# Altium schematic sheet DeviceControl.SchDoc
size A2
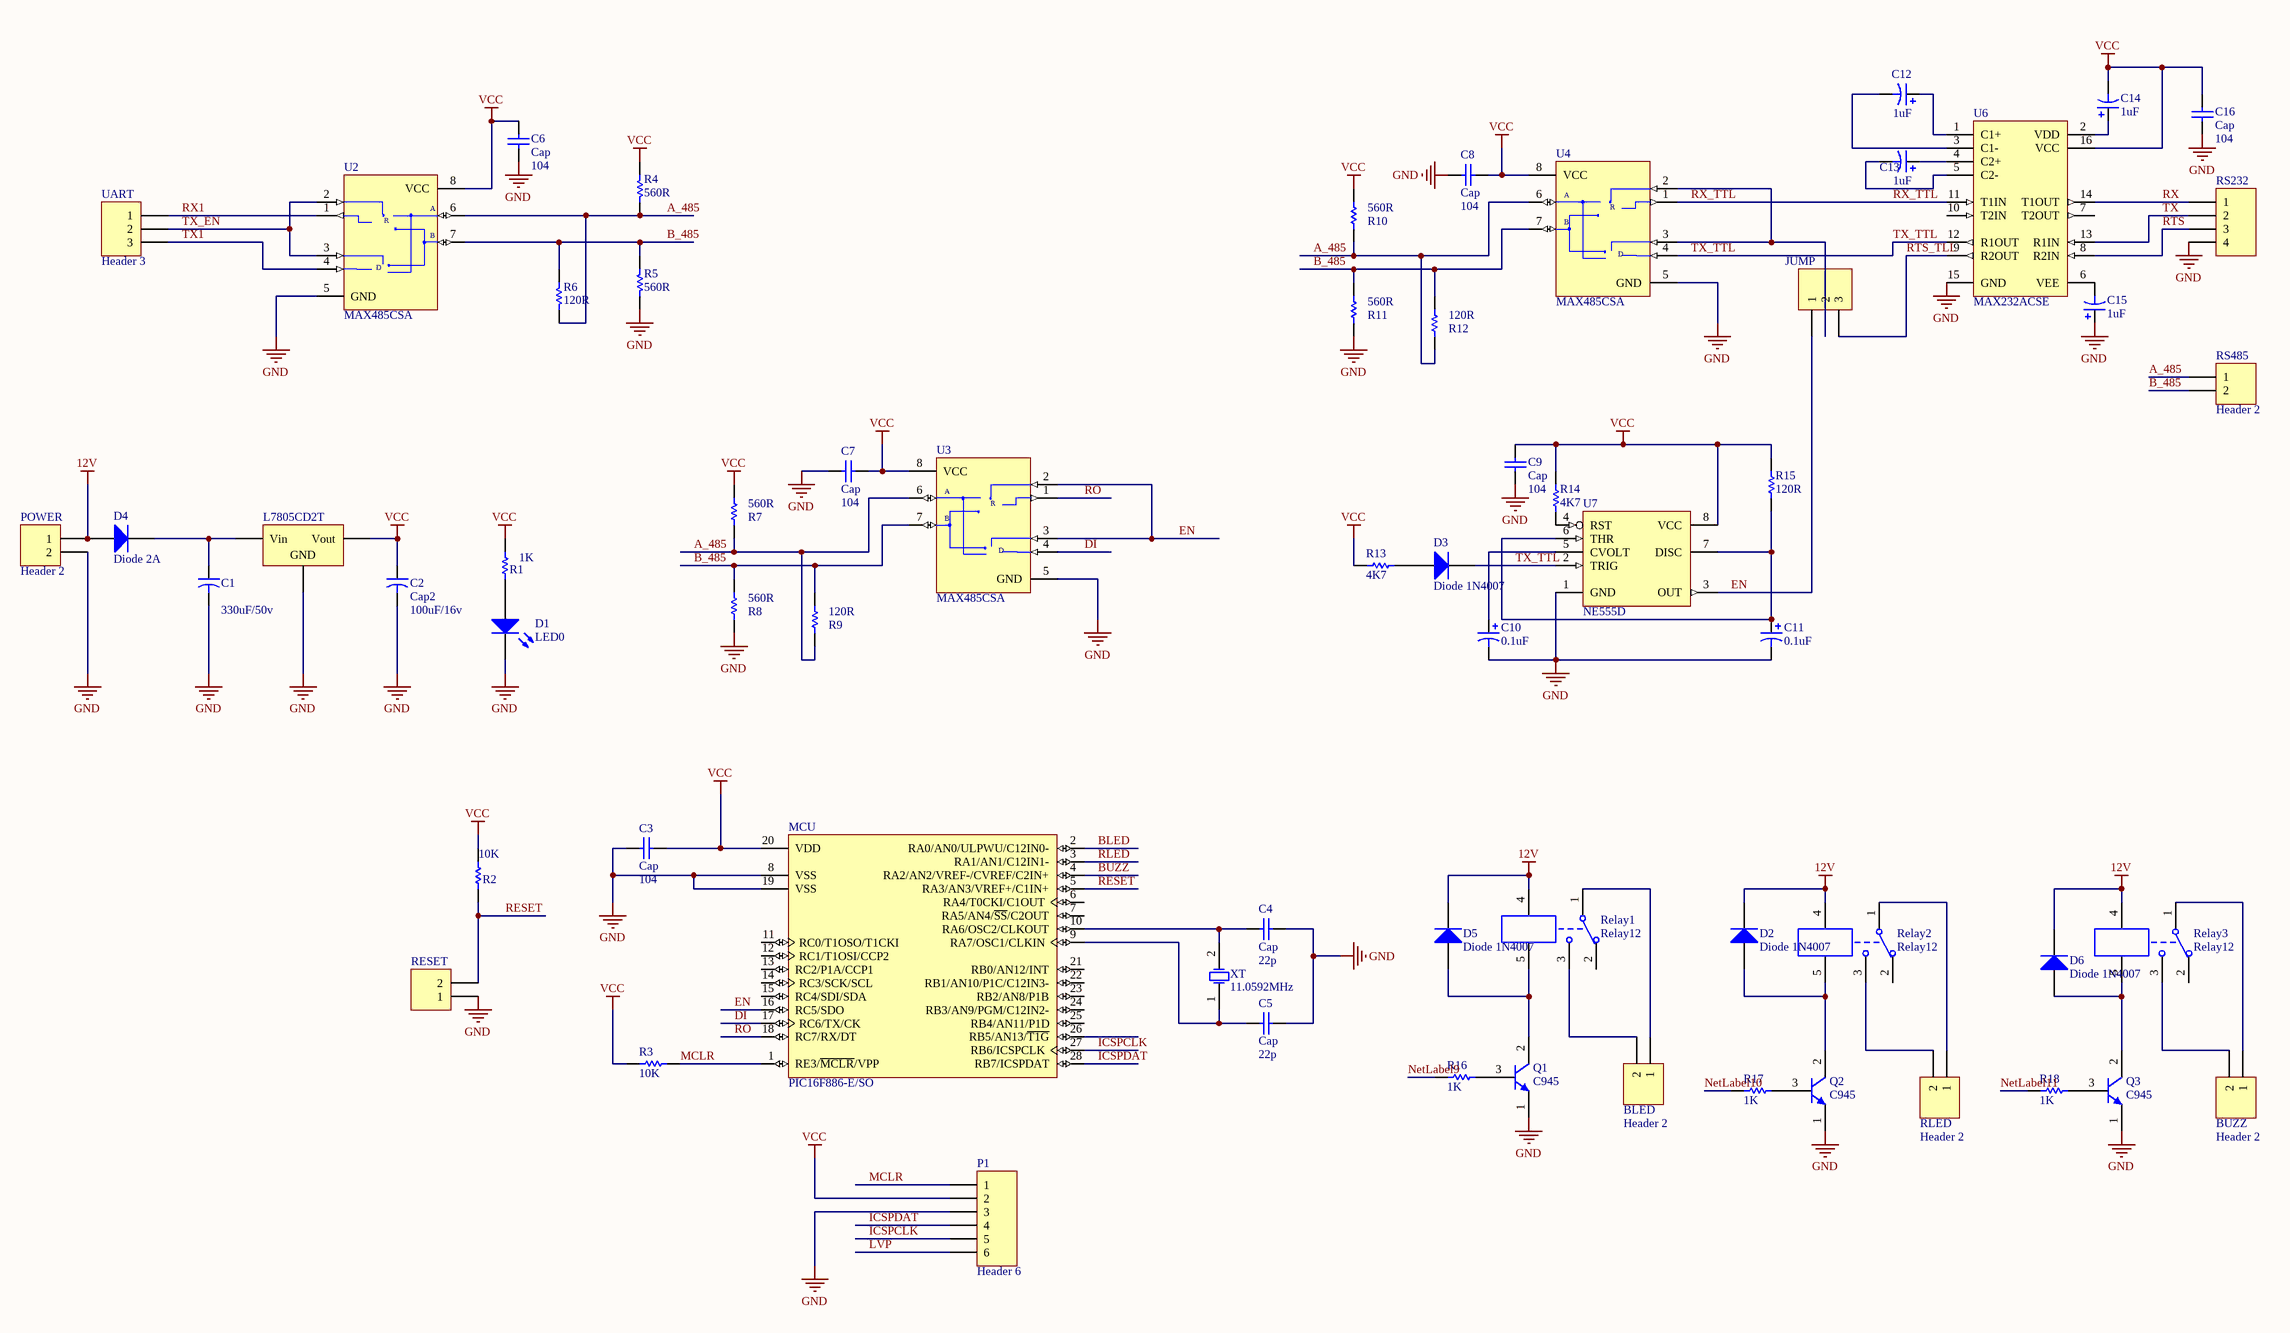
[diagram p0: DeviceControl.SchDoc]

## Parts
BLED  Header 2  [Header2 - duplicate]
BUZZ  Header 2  [Header2 - duplicate]
C1  value 330uF/50v  [TU 220uF/50V]  (hidden comment: Cap2)
C2  Cap2  value 100uF/16v  [tu 100uF/50v]
C3  Cap  value 104  [C104_YELLOW]
C4  Cap  value 22p  [C104_PINK]
C5  Cap  value 22p  [C104_PINK]
C6  Cap  value 104  [C104_PINK]
C7  Cap  value 104  [C104_YELLOW]
C8  Cap  value 104  [C104_PINK]
C9  Cap  value 104  [C104_PINK]
C10  value 0.1uF  [C104_YELLOW]  (hidden comment: Cap Pol1)
C11  value 0.1uF  [C104_YELLOW]  (hidden comment: Cap Pol1)
C12  value 1uF  [tu 10uF]  (hidden comment: Cap Pol1)
C13  value 1uF  [tu 10uF]  (hidden comment: Cap Pol1)
C14  value 1uF  [tu 10uF]  (hidden comment: Cap Pol1)
C15  value 1uF  [tu 10uF]  (hidden comment: Cap Pol1)
C16  Cap  value 104  [C104_PINK]
D1  LED0  [LED_3]
D2  Diode 1N4007  [DIO10.46-5.3x2.8]
D3  Diode 1N4007  [D_1A]
D4  Diode 2A  [D_2A]
D5  Diode 1N4007  [DIO10.46-5.3x2.8]
D6  Diode 1N4007  [DIO10.46-5.3x2.8]
JUMP  Header 3  [HDR1X3]  (value not drawn)
L7805CD2T  Volt Reg  [TO254P1510-3_4N]  (value not drawn)
MCU  PIC16F886-E/SO  [SOIC-SO28_N]
P1  Header 6  [HDR1X6]
POWER  Header 2  [Header2 - duplicate]
Q1  C945  [C1815]
Q2  C945  [C1815]
Q3  C945  [C1815]
R1  1K  [R_Nor]
R2  10K  [R_Nor]
R3  10K  [R_Nor]
R4  560R  [R_Nor]
R5  560R  [R_Nor]
R6  120R  [R_Nor]
R7  560R  [R_Nor]
R8  560R  [R_Nor]
R9  120R  [R_Nor]
R10  560R  [R_Nor]
R11  560R  [R_Nor]
R12  120R  [R_Nor]
R13  4K7  [R_Nor]
R14  4K7  [R_Nor]
R15  120R  [R_Nor]
R16  1K  [R_Nor]
R17  1K  [R_Nor]
R18  1K  [R_Nor]
Relay1  Relay12  [Role 12V]
Relay2  Relay12  [Role 12V]
Relay3  Relay12  [Role 12V]
RESET  Header 2  [Header2 - duplicate]  (value not drawn)
RLED  Header 2  [Header2 - duplicate]
RS232  Header 4  [HDR1X4]  (value not drawn)
RS485  Header 2  [HDR1X2]
U2  MAX485CSA  [NSO8_N]
U3  MAX485CSA  [NSO8_N]
U4  MAX485CSA  [NSO8_N]
U6  MAX232ACSE  [NSO16_N]
U7  NE555D  [D008_N]
UART  Header 3  [HDR1X3]
XT  value 11.0592MHz  [Xtal12M]  (hidden comment: XTAL)

## Nets
12V: D2.2(K) D4.1(A) D5.2(K) D6.2(K) POWER.1 Relay1.4 Relay2.4 Relay3.4
GND: C1.2 C2.2 C3.2 C4.2 C5.2 C6.2 C7.1 C8.1 C9.1 C10.2 C11.2 C15.1 C16.1 D1.2(K) L7805CD2T.2(GND) MCU.8(VSS) MCU.19(VSS) P1.3 POWER.2 Q1.1(E) Q2.1(E) Q3.1(E) R5.1 R8.1 R11.1 RESET.1 RS232.4 U2.5(GND) U3.5(GND) U4.5(GND) U6.15(GND) U7.1(GND)
VCC: C2.1 C3.1 C6.1 C7.2 C8.2 C9.2 C14.2 C16.2 L7805CD2T.3(Vout) MCU.20(VDD) P1.2 R1.2 R2.2 R3.2 R4.2 R7.2 R10.2 R13.2 R14.1 R15.1 U2.8(VCC) U3.8(VCC) U4.8(VCC) U6.16(VCC) U7.8(VCC)
A_485: R4.1 R6.1 R7.1 R9.1 R10.1 R12.1 RS485.1 U2.6(A) U3.6(A) U4.6(A)
B_485: R5.2 R6.2 R8.2 R9.2 R11.2 R12.2 RS485.2 U2.7(B) U3.7(B) U4.7(B)
BLED: MCU.2(RA0/AN0/ULPWU/C12IN0-)
BUZZ: MCU.4(RA2/AN2/VREF-/CVREF/C2IN+)
DI: MCU.17(RC6/TX/CK) U3.4(DI)
EN: JUMP.1 MCU.16(RC5/SDO) U3.2(~{RE}) U3.3(DE) U7.3(OUT)
ICSPCLK: MCU.27(RB6/ICSPCLK) P1.5
ICSPDAT: MCU.28(RB7/ICSPDAT) P1.4
LVP: P1.6
MCLR: MCU.1(RE3/~{MCLR}/VPP) P1.1 R3.1
NetLabel9: R16.2
NetLabel10: R17.2
NetLabel11: R18.2
RESET: MCU.5(RA3/AN3/VREF+/C1IN+) R2.1 RESET.2
RLED: MCU.3(RA1/AN1/C12IN1-)
RO: MCU.18(RC7/RX/DT) U3.1(RO)
RTS: RS232.3 U6.8(R2IN)
RTS_TLL: JUMP.3 U6.9(R2OUT)
RX: RS232.1 U6.14(T1OUT)
RX1: U2.1(RO) UART.1
RX_TTL: U4.1(RO) U6.11(T1IN)
TX: RS232.2 U6.13(R1IN)
TX1: U2.4(DI) UART.3
TX_EN: U2.2(~{RE}) U2.3(DE) UART.2
TX_TTL: D3.2(K) U4.4(DI) U6.12(R1OUT) U7.2(TRIG)
NetBLED_1: BLED.1 Relay1.1
NetBLED_2: BLED.2 Relay1.3
NetBUZZ_1: BUZZ.1 Relay3.1
NetBUZZ_2: BUZZ.2 Relay3.3
NetC1_1: C1.1 D4.2(K) L7805CD2T.1(Vin)
NetC4_1: C4.1 MCU.10(RA6/OSC2/CLKOUT) XT.2(OSC2)
NetC5_1: C5.1 MCU.9(RA7/OSC1/CLKIN) XT.1(OSC1)
NetC10_1: C10.1 U7.5(CVOLT)
NetC11_1: C11.1 R15.2 U7.6(THR) U7.7(DISC)
NetC12_1: C12.1 U6.1(C1+)
NetC12_2: C12.2 U6.3(C1-)
NetC13_1: C13.1 U6.4(C2+)
NetC13_2: C13.2 U6.5(C2-)
NetC14_1: C14.1 U6.2(VDD)
NetC15_2: C15.2 U6.6(VEE)
NetD1_1: D1.1(A) R1.1
NetD2_1: D2.1(A) Q2.2(C) Relay2.5
NetD3_1: D3.1(A) R13.1
NetD5_1: D5.1(A) Q1.2(C) Relay1.5
NetD6_1: D6.1(A) Q3.2(C) Relay3.5
NetJUMP_2: JUMP.2 U4.2(~{RE}) U4.3(DE)
NetQ1_3: Q1.3(B) R16.1
NetQ2_3: Q2.3(B) R17.1
NetQ3_3: Q3.3(B) R18.1
NetR14_2: R14.2 U7.4(RST)
NetRelay2_1: Relay2.1 RLED.1
NetRelay2_3: Relay2.3 RLED.2

Not connected (* = marked no-connect by the designer): MCU 6(RA4/T0CKI/C1OUT) 7(RA5/AN4/~{SS}/C2OUT) 11(RC0/T1OSO/T1CKI) 12(RC1/T1OSI/CCP2) 13(RC2/P1A/CCP1) 14(RC3/SCK/SCL) 15(RC4/SDI/SDA) 21(RB0/AN12/INT) 22(RB1/AN10/P1C/C12IN3-) 23(RB2/AN8/P1B) 24(RB3/AN9/PGM/C12IN2-) 25(RB4/AN11/P1D) 26(RB5/AN13/~{T1G}); Relay1 2; Relay2 2; Relay3 2; U6 7(T2OUT) 10(T2IN)

## Notes on the sheet
- (in symbol MAX485CSA) R; D

## Library data of the parts
BLED BUZZ POWER RESET RLED RS485 = Header 2: Header, 2-Pin; LatestRevisionDate: 17-Jul-2002; LatestRevisionNote: Re-released for DXP Platform.; Publisher: Altium Limited
C1 C2 = Cap2: Capacitor; Published: 23-Sep-2002; PackageReference: CAPR5-4X5; Publisher: Altium Limited
C3-C9 C16 = Ceramic: Capcitor
C10-C15 = Cap Pol1: Polarized Capacitor (Radial); Published: 8-Jun-2000; LatestRevisionDate: 17-Jul-2002; LatestRevisionNote: Re-released for DXP Platform.; PackageReference: RB7.6-15; Publisher: Altium Limited
D1 = LED0: Typical INFRARED GaAs LED; Published: 8-Jun-2000; LatestRevisionDate: 08-Jul-2005; LatestRevisionNote: Mech Layer 1 removed.; PackageReference: LED-0; Publisher: Altium Limited
D2-D6 = Diode 1N4007: 1 Amp General Purpose Rectifier; Published: 8-Jun-2000; LatestRevisionDate: 17-Jul-2002; LatestRevisionNote: Re-released for DXP Platform.; DatasheetVersion: 1998; PackageVersion: Aug-1999; PackageReference: DO-41; Publisher: Altium Limited; Code_JEDEC: DO-204-AL; ComponentLink1Description: Manufacturer Link; ComponentLink1URL: http://www.fairchildsemi.com/; ComponentLink2Description: Datasheet; ComponentLink2URL: http://www.fairchildsemi.com/ds/1N%2F1N4001.pdf
JUMP UART = Header 3: Header, 3-Pin; LatestRevisionDate: 17-Jul-2002; LatestRevisionNote: Re-released for DXP Platform.; Publisher: Altium Limited
L7805CD2T = Volt Reg: Voltage Regulator; Published: 24-Mar-1999; LatestRevisionDate: 29-May-2009; LatestRevisionNote: IPC-7351 Footprint Added.; PackageReference: D2PAK; Publisher: Altium Limited; PackageDescription: 3-Pin Transistor Outline Package 2.54 mm Pitch, 15.1 mm Lead Span
MCU = PIC16F886-E/SO: Flash-Based, 8-Bit CMOS Microcontroller with nanoWatt Technology, 8K (x14-Bit words) Program Memory, 624 Bytes Data Memory, 24 I/O pins, 28-Pin SOIC, Standard VDD Range, Extended Temperature; FirstPublished: 29-Jan-2009; LatestRevisionDate: 02-Dec-2009; LatestRevisionNote: Updated datasheet to version revF, Apr-2009.; DatasheetVersion: revF, Apr-2009; PackageVersion: revBB, Aug-2009; PackageReference: SOIC-SO28; Publisher: Altium Limited; PackageDescription: 28-Lead Plastic Small Outline (SO) - Wide 7.50mm Body [SOIC]; Supplier 1: Digi-Key; Supplier Part Number 1: PIC16F886-E/SO-ND; Supplier 2: Newark; Supplier Part Number 2: 74K8572; Code_JEDEC: MS-013; ComponentLink1Description: Datasheet; ComponentLink1URL: http://ww1.microchip.com/downloads/en/DeviceDoc/41291F.pdf; ComponentLink2Description: Packaging Specification; ComponentLink2URL: http://www.microchip.com/stellent/groups/techpub_sg/documents/packagingspec/en012702.pdf; ComponentLink3Description: Microchip.com Home; ComponentLink3URL: http://www.microchip.com/
P1 = Header 6: Header, 6-Pin; LatestRevisionDate: 17-Jul-2002; LatestRevisionNote: Re-released for DXP Platform.; Publisher: Altium Limited
Q1-Q3 = 2N3904: NPN General Purpose Amplifier; Published: 8-Jun-2000; LatestRevisionDate: 15-Jan-2003; LatestRevisionNote: PCB Footprint 'BCY-W3/D4.7' replaced; DatasheetVersion: 1997; PackageVersion: Sep-1998; PackageReference: TO-92A; Publisher: Altium Limited; Code_JEDEC: TO-92A; ComponentLink1Description: Manufacturer Link; ComponentLink1URL: http://www.fairchildsemi.com/; ComponentLink2Description: Datasheet; ComponentLink2URL: http://www.fairchildsemi.com/ds/2N%2F2N3904.pdf
R1-R18 = Res
Relay1-Relay3 = Role_12V
RS232 = Header 4: Header, 4-Pin; LatestRevisionDate: 17-Jul-2002; LatestRevisionNote: Re-released for DXP Platform.; Publisher: Altium Limited
U2-U4 = MAX485CSA: Low-Power, Slew-Rate-Limited RS-485/RS-422 Transceiver; Published: 16-Jan-2001; LatestRevisionDate: 13-Apr-2006; LatestRevisionNote: IPC-7351 Footprint Added.; DatasheetVersion: Feb-1996; PackageReference: NSO8; Publisher: Altium Limited; PackageDescription: 8-Pin Small Outline Integrated Circuit 1.27 mm Pitch; Code_JEDEC: MS-012-AA; Code_IPC: SOIC127P600-8; ComponentLink1Description: Manufacturer Link; ComponentLink1URL: http://www.maxim-ic.com/; ComponentLink2Description: Datasheet; ComponentLink2URL: http://pdfserv.maxim-ic.com/en/ds/MAX1487-MAX491.pdf
U6 = MAX232ACSE: +5V Powered, Multi-Channel RS-232 Driver/Receiver; Published: 16-Jan-2001; LatestRevisionDate: 13-Apr-2006; LatestRevisionNote: IPC-7351 Footprint Added.; PackageReference: NSO16; Publisher: Altium Limited; PackageDescription: 16-Pin Small Outline Integrated Circuit 1.27 mm Pitch; Code_JEDEC: MS-012-AC; Code_IPC: SOIC127P600-16; ComponentLink1Description: Manufacturer Link; ComponentLink1URL: http://www.maxim-ic.com/; ComponentLink2Description: Datasheet; ComponentLink2URL: http://pdfserv.maxim-ic.com/en/ds/MAX220-MAX249.pdf
U7 = NE555D: Precision Timer; Published: 16-Jan-2001; LatestRevisionDate: 13-Apr-2006; LatestRevisionNote: IPC-7351 Footprint Added.; DatasheetVersion: Feb-1992; PackageVersion: Jan-1998; PackageReference: D008; Publisher: Altium Limited; PackageDescription: 8-Pin Small Outline Integrated Circuit 1.27 mm Pitch; Code_IPC: SOIC127P600-8; ComponentLink1Description: Manufacturer Link; ComponentLink1URL: http://www.ti.com/; ComponentLink2Description: Datasheet; ComponentLink2URL: http://www-s.ti.com/sc/ds/ne555.pdf
XT = XTAL: Crystal Oscillator; Published: 8-Jun-2000; LatestRevisionDate: 17-Jul-2002; LatestRevisionNote: Re-released for DXP Platform.; PackageReference: R38; Publisher: Altium Limited